# EAGLE schematic wm8731adapter (EAGLE 8.2.2)

## Sheet 1 of 2: power
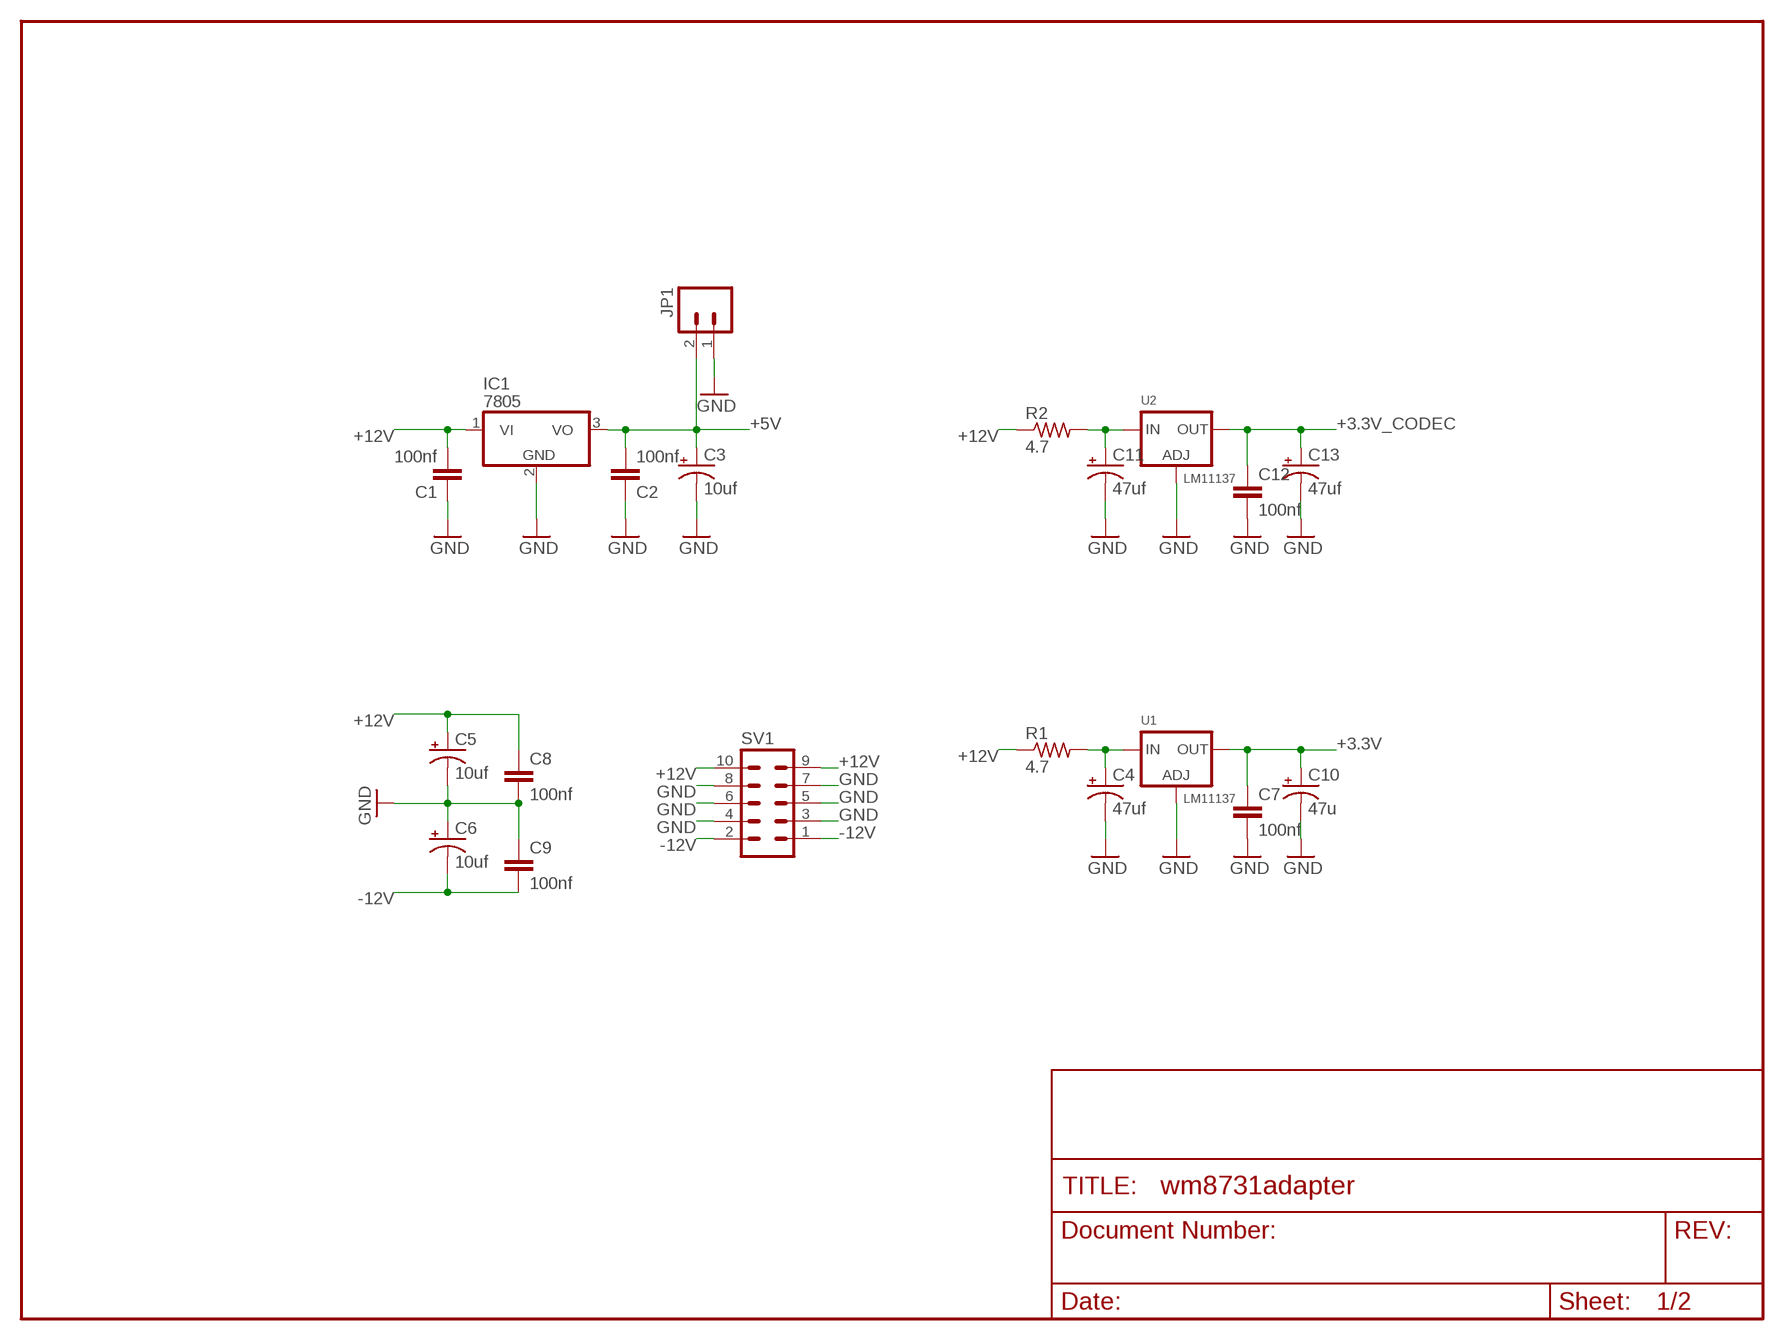
[diagram p0: schematic, sheet 1]

### Parts
C1  100nf  C-EUC0603  [C0603]
C2  100nf  C-EUC0603  [C0603]
C3  10uf  CPOL-USC  [PANASONIC_C]
C4  47uf  CPOL-USD  [PANASONIC_D]
C5  10uf  CPOL-USC  [PANASONIC_C]
C6  10uf  CPOL-USC  [PANASONIC_C]
C7  100nf  C-EUC0603  [C0603]
C8  100nf  C-EUC0603  [C0603]
C9  100nf  C-EUC0603  [C0603]
C10  47u  CPOL-USD  [PANASONIC_D]
C11  47uf  CPOL-USD  [PANASONIC_D]
C12  100nf  C-EUC0603  [C0603]
C13  47uf  CPOL-USD  [PANASONIC_D]
IC1  7805  7805TV  [TO220V]
JP1  M02_HEADERPOLAR  [MOLEX-1X2]
R1  4.7  R-US_R1206  [R1206]
R2  4.7  R-US_R1206  [R1206]
SV1  MA05-2  [MA05-2]
U1  LM11137  LM1117TO252  [TO252]
U2  LM11137  LM1117SOT223-REFLOW  [SOT223-R]

### Nets
+3.3V [power]: C7.1 C10.+ U1.3(OUT) ; also sheet 2
+3.3V_CODEC: C12.1 C13.+ U2.2(OUT) ; also sheet 2
+5V [power]: C2.2 C3.+ IC1.3(VO) JP1.2 ; also sheet 2
+12V [power]: C1.2 C5.+ C8.1 IC1.1(VI) R1.1 R2.1 SV1.9 SV1.10
-12V [power]: C6.- C9.2 SV1.1 SV1.2
GND [ground]: C1.1 C2.1 C3.- C4.- C5.- C6.+ C7.2 C8.2 C9.1 C10.- C11.- C12.2 C13.- IC1.2(GND) JP1.1 SV1.3 SV1.4 SV1.5 SV1.6 SV1.7 SV1.8 U1.1(ADJ) U2.1(ADJ) ; also sheet 2
N$4: C11.+ R2.2 U2.3(IN)
N$28: C4.+ R1.2 U1.2(IN)

## Sheet 2 of 2: core
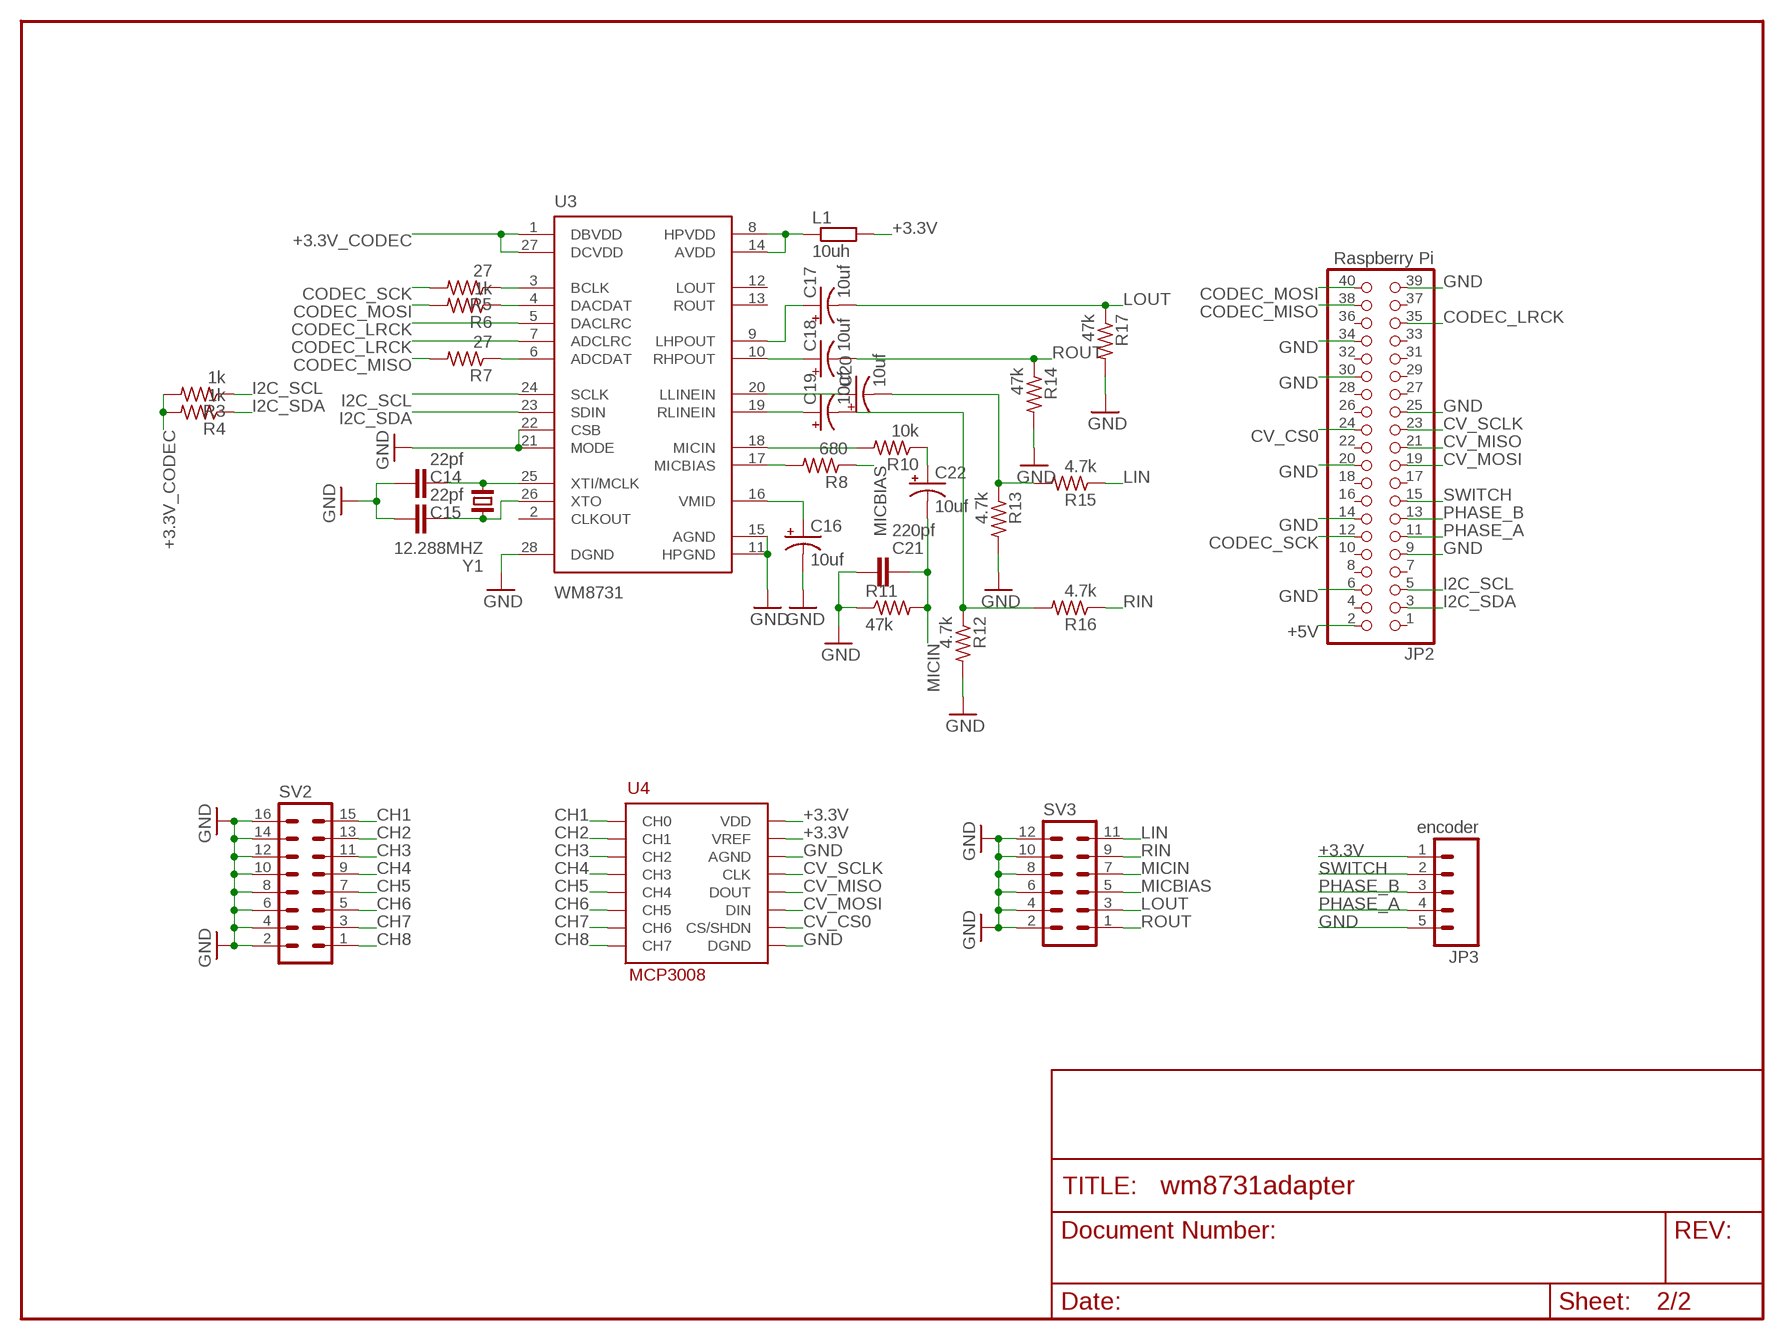
[diagram p1: schematic, sheet 2]

### Parts
C14  22pf  C-EUC0603  [C0603]
C15  22pf  C-EUC0603  [C0603]
C16  10uf  CPOL-USC  [PANASONIC_C]
C17  10uf  CPOL-USC  [PANASONIC_C]
C18  10uf  CPOL-USC  [PANASONIC_C]
C19  10uf  CPOL-USC  [PANASONIC_C]
C20  10uf  CPOL-USC  [PANASONIC_C]
C21  220pf  C-EUC0603  [C0603]
C22  10uf  CPOL-USC  [PANASONIC_C]
JP2  Raspberry Pi  PINHD-2X20  [2X20]
JP3  encoder  M05PTH  [1X05]
L1  10uh  RESISTOR10MM  [1/4W_RESISTOR]
R3  1k  R-US_R0603  [R0603]
R4  1k  R-US_R0603  [R0603]
R5  27  R-US_R0603  [R0603]
R6  1k  R-US_R0603  [R0603]
R7  27  R-US_R0603  [R0603]
R8  680  R-US_R0603  [R0603]
R10  10k  R-US_R0603  [R0603]
R11  47k  R-US_R0603  [R0603]
R12  4.7k  R-US_R0603  [R0603]
R13  4.7k  R-US_R0603  [R0603]
R14  47k  R-US_R0603  [R0603]
R15  4.7k  R-US_R0603  [R0603]
R16  4.7k  R-US_R0603  [R0603]
R17  47k  R-US_R0603  [R0603]
SV2  MA08-2  [MA08-2]
SV3  MA06-2  [MA06-2]
U3  WM8731  [SSOP28]
U4  MCP3008  [SOIC16]
Y1  12.288MHZ  CRYTALHCM49  [HC49UP]

### Nets
+3.3V [power]: JP3.1 L1.2 U4.15(VREF) U4.16(VDD) ; also sheet 1
+3.3V_CODEC: R3.2 R4.2 U3.1(DBVDD) U3.27(DCVDD) ; also sheet 1
+5V [power]: JP2.2 ; also sheet 1
CH1: SV2.15 U4.1(CH0)
CH2: SV2.13 U4.2(CH1)
CH3: SV2.11 U4.3(CH2)
CH4: SV2.9 U4.4(CH3)
CH5: SV2.7 U4.5(CH4)
CH6: SV2.5 U4.6(CH5)
CH7: SV2.3 U4.7(CH6)
CH8: SV2.1 U4.8(CH7)
CODEC_LRCK: JP2.35 U3.5(DACLRC) U3.7(ADCLRC)
CODEC_MISO: JP2.38 R7.2
CODEC_MOSI: JP2.40 R6.2
CODEC_SCK: JP2.12 R5.2
CV_CS0: JP2.24 U4.10(CS/SHDN)
CV_MISO: JP2.21 U4.12(DOUT)
CV_MOSI: JP2.19 U4.11(DIN)
CV_SCLK: JP2.23 U4.13(CLK)
GND [ground]: C14.2 C15.2 C16.- C21.1 JP2.6 JP2.9 JP2.14 JP2.20 JP2.25 JP2.30 JP2.34 JP2.39 JP3.5 R11.1 R12.2 R13.2 R14.2 R17.2 SV2.2 SV2.4 SV2.6 SV2.8 SV2.10 SV2.12 SV2.14 SV2.16 SV3.2 SV3.4 SV3.6 SV3.8 SV3.10 SV3.12 U3.11(HPGND) U3.15(AGND) U3.21(MODE) U3.22(CSB) U3.28(DGND) U4.9(DGND) U4.14(AGND) ; also sheet 1
I2C_SCL: JP2.5 R3.1 U3.24(SCLK)
I2C_SDA: JP2.3 R4.1 U3.23(SDIN)
LIN: R15.1 SV3.11
LOUT: C17.- R17.1 SV3.3
MICBIAS: R8.1 SV3.5
MICIN: C21.2 C22.- R11.2 SV3.7
N$1: R5.1 U3.3(BCLK)
N$2: R6.1 U3.4(DACDAT)
N$3: R7.1 U3.6(ADCDAT)
N$5: C19.- R12.1 R16.2
N$6: C20.+ U3.20(LLINEIN)
N$7: C19.+ U3.19(RLINEIN)
N$8: C20.- R13.1 R15.2
N$9: R8.2 U3.17(MICBIAS)
N$10: R10.2 U3.18(MICIN)
N$11: C22.+ R10.1
N$15: L1.1 U3.8(HPVDD) U3.14(AVDD)
N$16: C17.+ U3.9(LHPOUT)
N$17: C16.+ U3.16(VMID)
N$18: C14.1 U3.25(XTI/MCLK) Y1.2
N$20: C15.1 U3.26(XTO) Y1.1
N$22: C18.+ U3.10(RHPOUT)
PHASE_A: JP2.11 JP3.4
PHASE_B: JP2.13 JP3.3
RIN: R16.1 SV3.9
ROUT: C18.- R14.1 SV3.1
SWITCH: JP2.15 JP3.2
Unconnected: JP2.1 JP2.4 JP2.7 JP2.8 JP2.10 JP2.16 JP2.17 JP2.18 JP2.22 JP2.26 JP2.27 JP2.28 JP2.29 JP2.31 JP2.32 JP2.33 JP2.36 JP2.37 U3.2(CLKOUT) U3.12(LOUT) U3.13(ROUT)

## Library data of the parts
C1 C2 C7-C9 C12 C14 C15 C21 = rcl:C-EU: CAPACITOR, European symbol
C3-C6 C10 C11 C13 C16-C20 C22 = rcl:CPOL-US: POLARIZED CAPACITOR, American symbol
IC1 = linear:78*: Positive VOLTAGE REGULATOR Source: http://cache.national.com/ds/LM/LM78L05.pdf http://www.fairchildsemi.com/ds/LM/LM7805.pdf
JP1 = Icotech_Eagle_Library:M02_HEADER: Header 2 Standard 2-pin 0.1" header. Use with straight break away headers (SKU : PRT-00116), right angle break away headers (PRT-00553), swiss pins (PRT-00743), machine pins (PRT-00117), and female headers (PRT-00115). Molex polarized connector foot print use with SKU : PRT-08233 with associated crimp pins and housings.
JP2 = pinhead:PINHD-2X20: PIN HEADER
JP3 = ModernDevice:M05: Header 5 Standard 5-pin 0.1" header. Use with straight break away headers (SKU : PRT-00116), right angle break away headers (PRT-00553), swiss pins (PRT-00743), machine pins (PRT-00117), and female headers (PRT-00115). Molex polarized connector foot print use with SKU : PRT-08230 with associated crimp pins and housings.
L1 = kweiwen:*RESISTOR*: Standard resistor, various versions
R1-R8 R10-R17 = resistor:R-US_: RESISTOR, American symbol
SV1 = con-lstb:MA05-2: PIN HEADER; OC_FARNELL: unknown; OC_NEWARK: unknown
SV2 = con-lstb:MA08-2: PIN HEADER; OC_FARNELL: unknown; OC_NEWARK: unknown
SV3 = con-lstb:MA06-2: PIN HEADER; OC_FARNELL: unknown; OC_NEWARK: unknown
U1 U2 = microbuilder:LM1117: LM1117 Voltage Regulator LM1117 Adjustable Voltage regulator [Digikey: LM1117IMP-ADJDKR-ND] LM1117 3.3V Voltage regulator [AP1117E33GDIDKR-ND] LM1117 5.0V Voltage regulator [AP1117E50GDIDKR-ND] SOT223-REFLOW - SOT223 package for solder paste/reflow ovens SOT223-WAVE - SOT223 package for hand-soldering (larger pads) Note: For the fixed-voltage regulators, simply set the ADJ pin to GND.
U3 = wm8731:WM8731
U4 = pimoroni:MCP3008
Y1 = crystal:CRYTAL: CRYSTAL

## Net classes
0 default: width 0.406 mm
1 power: width 0.406 mm
2 ground: width 0.406 mm